# Altium schematic sheet Wireless Weather Station.SchDoc
size A4; SheetNumber: 1; SheetTotal: 1
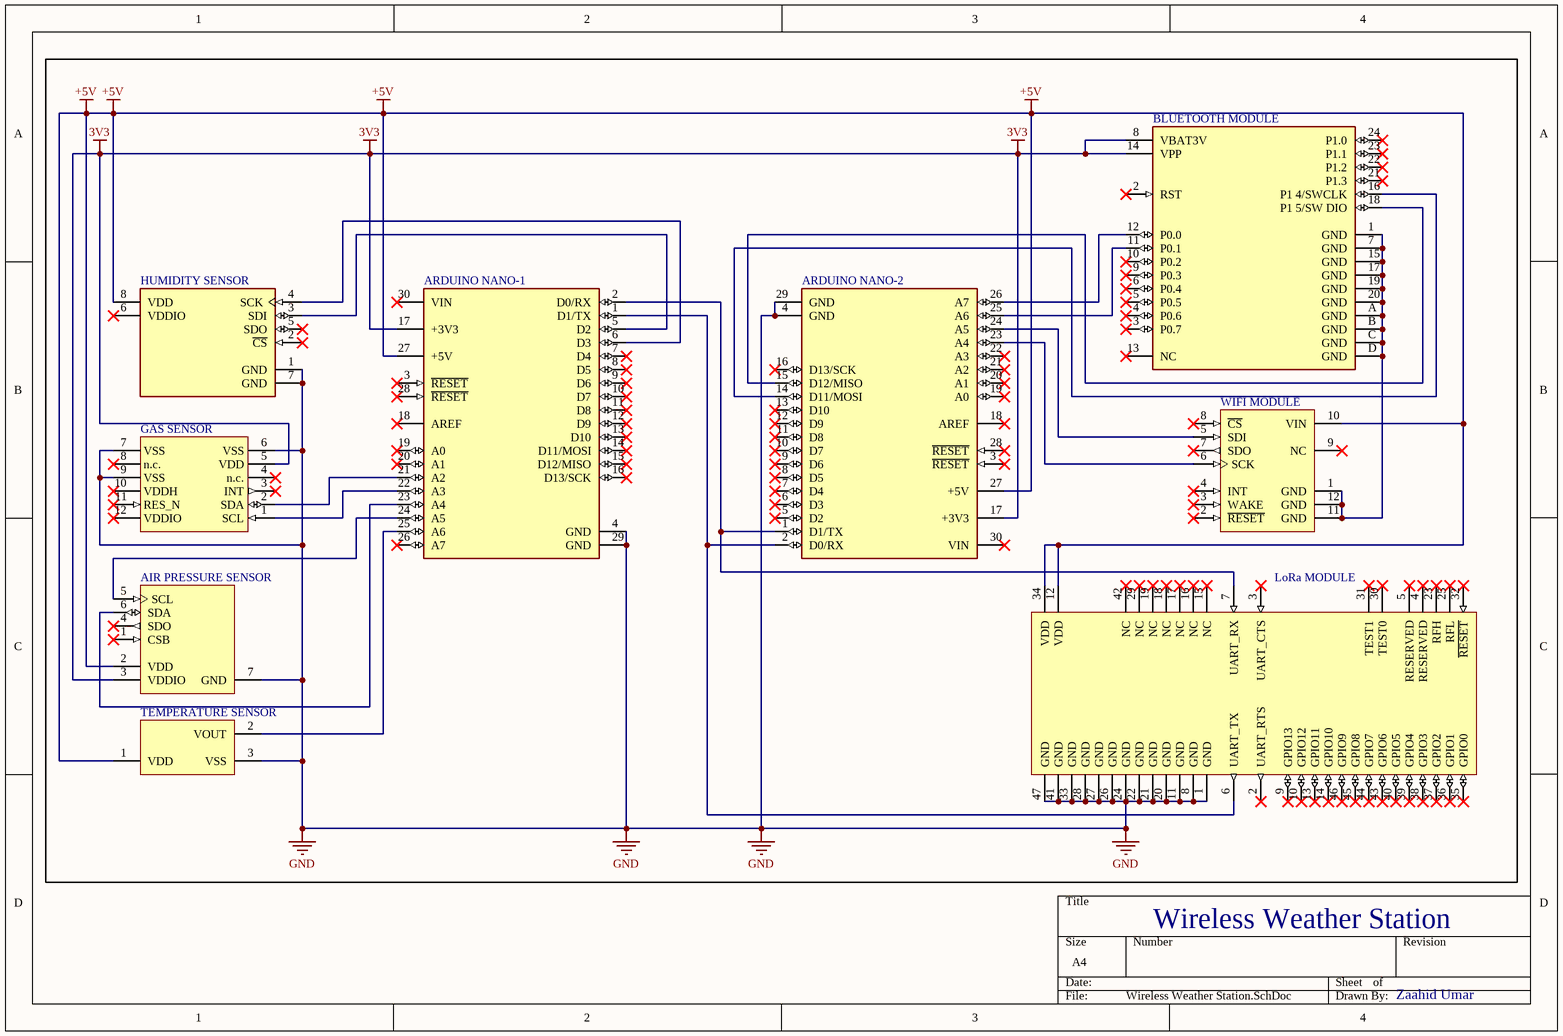
[diagram p0: Wireless Weather Station.SchDoc]

## Parts
AIR_PRESSURE_SENSOR  BMP180  [BOSC-BMP180-7_V]  (value not drawn)
ARDUINO_NANO-1  A000005  [FP-A000005-MFG]  (value not drawn)
ARDUINO_NANO-2  A000005  [FP-A000005-MFG]  (value not drawn)
BLUETOOTH_MODULE  ENW-89846A1KF  [FP-ENW-89846A1KF-MFG]  (value not drawn)
GAS_SENSOR  ZMOD4510AI1V  [ZMODxxxx 12 Leads- LGG12]  (value not drawn)
HUMIDITY_SENSOR  BME280  [FP-BME280-MFG]  (value not drawn)
LoRa_MODULE  RN2483-I/RM095  [MCHP-RN2483-47_V]  (value not drawn)
TEMPERATURE_SENSOR  TC1047AVNBTR  [SOT-23-NB3_L]  (value not drawn)
WIFI_MODULE  MRF24J40MA-I/RM  [MRF24J40MA]  (value not drawn)

## Nets
3V3: AIR_PRESSURE_SENSOR.3(VDDIO) ARDUINO_NANO-1.17(+3V3) ARDUINO_NANO-2.17(+3V3) BLUETOOTH_MODULE.8(VBAT3V) BLUETOOTH_MODULE.14(VPP) GAS_SENSOR.5(VDD)
+5V: AIR_PRESSURE_SENSOR.2(VDD) ARDUINO_NANO-1.27(+5V) ARDUINO_NANO-2.27(+5V) HUMIDITY_SENSOR.8(VDD) LoRa_MODULE.12(VDD) LoRa_MODULE.34(VDD) TEMPERATURE_SENSOR.1(VDD) WIFI_MODULE.10(VIN)
GND: AIR_PRESSURE_SENSOR.7(GND) ARDUINO_NANO-1.4(GND) ARDUINO_NANO-1.29(GND) ARDUINO_NANO-2.4(GND) ARDUINO_NANO-2.29(GND) GAS_SENSOR.6(VSS) GAS_SENSOR.7(VSS) GAS_SENSOR.9(VSS) HUMIDITY_SENSOR.1(GND) HUMIDITY_SENSOR.7(GND) LoRa_MODULE.1(GND) LoRa_MODULE.8(GND) LoRa_MODULE.11(GND) LoRa_MODULE.20(GND) LoRa_MODULE.21(GND) LoRa_MODULE.22(GND) LoRa_MODULE.24(GND) LoRa_MODULE.26(GND) LoRa_MODULE.27(GND) LoRa_MODULE.28(GND) LoRa_MODULE.33(GND) LoRa_MODULE.41(GND) LoRa_MODULE.47(GND) TEMPERATURE_SENSOR.3(VSS)
NetAIR_PRESSURE_SENSOR_5: AIR_PRESSURE_SENSOR.5(SCL) ARDUINO_NANO-1.24(A5)
NetAIR_PRESSURE_SENSOR_6: AIR_PRESSURE_SENSOR.6(SDA) ARDUINO_NANO-1.23(A4)
NetARDUINO_NANO-1_1: ARDUINO_NANO-1.1(D1/TX) ARDUINO_NANO-2.2(D0/RX) LoRa_MODULE.6(UART_TX)
NetARDUINO_NANO-1_2: ARDUINO_NANO-1.2(D0/RX) ARDUINO_NANO-2.1(D1/TX) LoRa_MODULE.7(UART_RX)
NetARDUINO_NANO-1_5: ARDUINO_NANO-1.5(D2) HUMIDITY_SENSOR.3(SDI)
NetARDUINO_NANO-1_6: ARDUINO_NANO-1.6(D3) HUMIDITY_SENSOR.4(SCK)
NetARDUINO_NANO-1_21: ARDUINO_NANO-1.21(A2) GAS_SENSOR.2(SDA)
NetARDUINO_NANO-1_22: ARDUINO_NANO-1.22(A3) GAS_SENSOR.1(SCL)
NetARDUINO_NANO-1_25: ARDUINO_NANO-1.25(A6) TEMPERATURE_SENSOR.2(VOUT)
NetARDUINO_NANO-2_14: ARDUINO_NANO-2.14(D11/MOSI) BLUETOOTH_MODULE.16(P1_4/SWCLK)
NetARDUINO_NANO-2_15: ARDUINO_NANO-2.15(D12/MISO) BLUETOOTH_MODULE.18(P1_5/SW_DIO)
NetARDUINO_NANO-2_23: ARDUINO_NANO-2.23(A4) WIFI_MODULE.6(SCK)
NetARDUINO_NANO-2_24: ARDUINO_NANO-2.24(A5) WIFI_MODULE.5(SDI)
NetARDUINO_NANO-2_25: ARDUINO_NANO-2.25(A6) BLUETOOTH_MODULE.11(P0.1)
NetARDUINO_NANO-2_26: ARDUINO_NANO-2.26(A7) BLUETOOTH_MODULE.12(P0.0)
NetBLUETOOTH_MODULE_1: BLUETOOTH_MODULE.1(GND) BLUETOOTH_MODULE.7(GND) BLUETOOTH_MODULE.15(GND) BLUETOOTH_MODULE.17(GND) BLUETOOTH_MODULE.19(GND) BLUETOOTH_MODULE.20(GND) BLUETOOTH_MODULE.A(GND) BLUETOOTH_MODULE.B(GND) BLUETOOTH_MODULE.C(GND) BLUETOOTH_MODULE.D(GND) WIFI_MODULE.1(GND) WIFI_MODULE.11(GND) WIFI_MODULE.12(GND)

Not connected (* = marked no-connect by the designer): AIR_PRESSURE_SENSOR 1(CSB)* 4(SDO)*; ARDUINO_NANO-1 3(~{RESET})* 7(D4)* 8(D5)* 9(D6)* 10(D7)* 11(D8)* 12(D9)* 13(D10)* 14(D11/MOSI)* 15(D12/MISO)* 16(D13/SCK)* 18(AREF)* 19(A0)* 20(A1)* 26(A7)* 28(~{RESET})* 30(VIN)*; ARDUINO_NANO-2 3(~{RESET})* 5(D2)* 6(D3)* 7(D4)* 8(D5)* 9(D6)* 10(D7)* 11(D8)* 12(D9)* 13(D10)* 16(D13/SCK)* 18(AREF)* 19(A0)* 20(A1)* 21(A2)* 22(A3)* 28(~{RESET})* 30(VIN)*; BLUETOOTH_MODULE 2(RST)* 3(P0.7)* 4(P0.6)* 5(P0.5)* 6(P0.4)* 9(P0.3)* 10(P0.2)* 13(NC)* 21(P1.3)* 22(P1.2)* 23(P1.1)* 24(P1.0)*; GAS_SENSOR 3(INT)* 4(n.c.)* 8(n.c.)* 10(VDDH)* 11(RES_N)* 12(VDDIO)*; HUMIDITY_SENSOR 2(~{CS})* 5(SDO)* 6(VDDIO)*; LoRa_MODULE 2(UART_RTS)* 3(UART_CTS)* 4(RESERVED)* 5(RESERVED)* 9(GPIO13)* 10(GPIO12)* 13(GPIO11)* 14(GPIO10)* 15(NC)* 16(NC)* 17(NC)* 18(NC)* 19(NC)* 23(RFH)* 25(RFL)* 29(NC)* 30(TEST0)* 31(TEST1)* 32(~{RESET})* 35(GPIO0)* 36(GPIO1)* 37(GPIO2)* 38(GPIO3)* 39(GPIO4)* 40(GPIO5)* 42(NC)* 43(GPIO6)* 44(GPIO7)* 45(GPIO8)* 46(GPIO9)*; WIFI_MODULE 2(~{RESET})* 3(WAKE)* 4(INT)* 7(SDO)* 8(~{CS})* 9(NC)*

## Notes on the sheet
- Wireless Weather Station
- Zaahid Umar

## Library data of the parts
AIR_PRESSURE_SENSOR = CMP-2000-05074-1: Digital Pressure Sensor, 1.8 to 3.6 V, -40 to 85 degC, 7-Pin LGA, RoHS; Manufacturer: Bosch Sensortec; Output Type: I²C; Other Names: 0273.300.244-1NV / 828-1027-2; Pressure Type: Absolute; Maximum Pressure: 145.04PSI(1000kPa); Voltage - Supply: 1.62V~3.6V; EDA / CAD Models: DownloadfromAcceleratedDesigns; Accuracy: ±2%; Port Style: NoPort; For Use With: 1528-1434-ND / -BMP180BAROMETRICPRESS/TEMP5V / 1528-1435-ND / -L3GD20HLSM303BMP18010DOFIMU / 1568-1260-ND / -SPARKFUNBAROMETRICPRESSURESEN / 1597-1301-ND / -GROVEBAROMETERSENSOR / 1597-1302-ND / -GROVEIMU10DOF / 1471-1581-ND / -10DOFCLICK / 101040003-ND / -XADOWBAROMETERBMP180V1.0 / 101040004-ND / -XADOW-IMU10DOF / 114990245-ND / -BOARDTPHPRESSURETEMPREV.4 / 828-1028-ND / -BMP180SHUTTLEBOARDFORDEVKIT / 103990031-ND / -TPHBOARDTHETEMPERATUREPRESSU; Operating Pressure: 4.35PSI~15.95PSI(30kPa~110kPa); Output: 16~19b; Supplier Device Package: 7-LGA; Operating Temperature: -40degC~85degC; Standard Package: 5,000; Package / Case: 7-VLGA; Manufacturer URL: http://www.bosch-sensortec.com; Category: Sensors,Transducers; Datasheet URL: http://media.digikey.com/pdf/Data%20Sheets/Bosch/BMP180.pdf; Family: PressureSensors,Transducers; Termination Style: PCB; Datasheet Version: Rev. 2.4, 01/2012
ARDUINO_NANO-1 ARDUINO_NANO-2 = CMP-189986-000002-1: ARDUINO NANO ATMEGA328 EVAL BRD; Number of Bits: 8; Evaluation Kit: Yes; Operating Supply Voltage: 12V; Interface: I2C; Data Bus Width: 8b; Core Architecture: AVR; Packaging: Bulk; Length: 7inch; Package Quantity: 50; Width: 5inch; REACH SVHC: No SVHC; Weight: 0.358383oz; Series: AVR® ATmega; Height: 0.25inch
BLUETOOTH_MODULE = CMP-05527-000002-1: RF TXRX MOD BLUETOOTH CHIP ANT; Manufacturer: Panasonic; Number Of Gpio: 14; Number Of Adc Channels: 4; Max Frequency: 2.4GHz; Interface: I2C,SPI,UART; Sensitivity: -93dBm; Receiving Current: 4.9mA; Max Supply Voltage: 3.3V; Data Rate: 1Mbits/s; Min Supply Voltage: 2.35V; Temperature Range High: +85°C; Category: UNK; ComponentLink2Description: Datasheet; Temperature Range Low: -40°C; Lead Free: Yes; ComponentLink2URL: https://b2b-api.panasonic.eu/file_stream/pids/fileversion/4534; Digikey Description: RF TXRX MOD BLUETOOTH CHIP ANT; Ambient Temperature Range Low: -40°C; Device Class L2: RF Semiconductors and Devices; Ambient Temperature Range High: +85°C; Device Class L3: Transceivers; Height: 2mm; Package: 0; Automotive: No; Transmitting Current: 4.9mA; Temperature: -40°C to +85°C; Device Class L1: Integrated Circuits (ICs); Octopart: https://octopart.com/enw-89846a1kf-panasonic-38566823; RoHS: TRUE; Manufacturer Part Number: ENW-89846A1KF
GAS_SENSOR = CMP-00572-100129191-1: ZMOD4510AI1V ZMOD4510 Series 3.6 V 11 mA Gas Sensor Module for Outdoor Air Quality - LGA-12; NexarPartId: 100129191
HUMIDITY_SENSOR = CMP-2000-05073-3: SENSOR PRESSURE HUMIDITY TEMP; Sensor Type: Temperature; Accuracy: 3%; Response Time: 1s; Output Type: SPI; Min Operating Temperature: -40°C; Max Operating Temperature: 85°C; Case/Package: LGA; Packaging: Cut Tape; Mount: Surface Mount; Lead Free: Lead Free; Number of Pins: 8
LoRa_MODULE = CMP-2000-05219-1: Low-Power Long Range LoRa(TM) Technology Transceiver Module, 2.1 to 3.6 V, -40 to 85 degC, 47-Pin SMD, RoHS; Manufacturer: Microchip; Minimum Operating Supply Voltage: 2.1V; Maximum Operating Supply Voltage: 3.6V; Operating Band Frequency Range: 438,868MHz; Datasheet Version: Rev. A, 03/2015; Dimensions: 17.8x26.7x3mm; Operating Supply Voltage Range: 2.1to3.6V; Package Type: Module; Mounting Type: SurfaceMount; Manufacturer URL: http://www.microchip.com/; Length: 26.7mm; Minimum Operating Temperature: -40degC; Operating Temperature Range: -40to+85degC; Datasheet URL: http://datasheet.octopart.com/RN2483-I-RM095-Microchip-datasheet-44892142.pdf; Pin Count: 47; Width: 17.8mm; Maximum Operating Temperature: +85degC; Height: 3mm
TEMPERATURE_SENSOR = CMP-0192-00223-1: Precision Temperature-to-Voltage Converter, 3-Pin SOT-23, Extended Temperature, Tape and Reel; PackageVersion: revBB, Aug-2009; Code_IPC: SOT23-3; PackageDescription: 3-Lead Plastic Small Outline Transistor (NB) [SOT-23]; DatasheetVersion: revC, May-2005; PackageReference: SOT-23-NB3
WIFI_MODULE = CMP-0191-00063-1: 2.4 GHz IEEE Std. 802.15.4, RF Transceiver 12-Pin Module, Industrial Temperature; PackageReference: MRF24J40MA; DatasheetVersion: revB, Nov-2008; PackageDescription: Transceiver Module; SM; 12 Leads; Body 1.1 x 0.7 x 0.067" (LxWxH), 0.1" Pitch; PackageVersion: Nov-2008